# Altium schematic sheet Power_Input.SchDoc: Power input
size A4; SheetNumber: 1; SheetTotal: 10
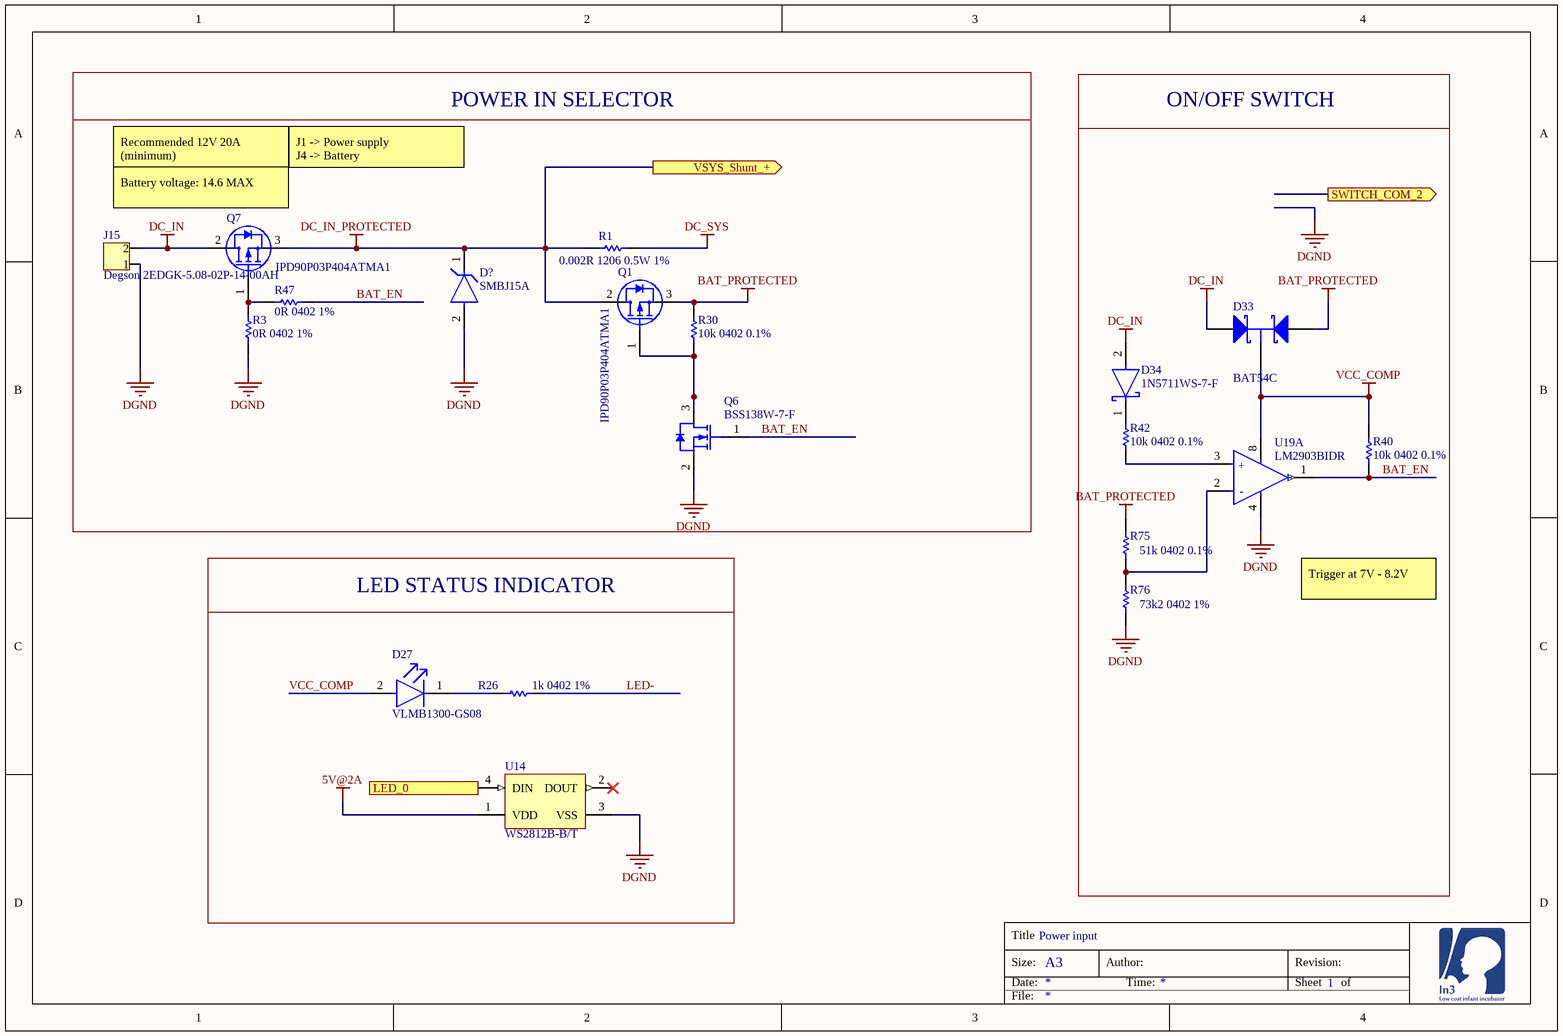
[diagram p0: Power_Input.SchDoc]

## Parts
D27  VLMB1300-GS08  [FP-6_541-5094_01-4-MFG]
D33  BAT54C  [NXP-SOT23-3_V]
D34  1N5711WS-7-F  [FP-SOD323-MFG]
D?  SMBJ15A  [FP-SMBJ-MFG]
J15  Degson 2EDGK-5.08-02P-14-00AH  [PCB-h4cyb3wxd4gf7j132tzl-1]
Q1  IPD90P03P404ATMA1  [DPAK IPD90P03P404ATMA1]
Q6  BSS138W-7-F  [DIOD-SOT323-3_V]
Q7  IPD90P03P404ATMA1  [DPAK IPD90P03P404ATMA1]
R1  0.002R 1206 0.5W 1%  [CAPC3216X180X55ML20T25]
R3  0R 0402 1%  [RESC1005X40X25ML05T10]
R26  1k 0402 1%  [RESC1005X40X25ML05T10]
R30  10k 0402 0.1%  [RESC1005X40X25ML05T10]
R40  10k 0402 0.1%  [RESC1005X40X25ML05T10]
R42  10k 0402 0.1%  [RESC1005X40X25ML05T10]
R47  0R 0402 1%  [RESC1005X40X25ML05T10]
R75  51k 0402 0.1%  [RESC1005X40X25ML05T10]
R76  73k2 0402 1%  [RESC1005X40X25ML05T10]
U14  WS2812B-B/T  [ADA-RGB-1655_V]
U19  LM2903BIDR  [FP-D0008A-MFG]  (part A of 2)

## Blocks framed on the sheet
POWER IN SELECTOR: D? J15 Q1 Q6 Q7 R1 R3 R30 R47
ON/OFF SWITCH: D33 D34 R40 R42 R75 R76 U19
LED STATUS INDICATOR: D27 R26 U14

## Ports
LED_0 (out), SWITCH_COM_2 (out), VSYS_Shunt_+ (out)

## Nets
5V@2A: U14.1(VDD)
BAT_PROTECTED: D33.2(A) Q1.3(S) R30.1 R75.2
DC_IN: D33.1(A) D34.2(A) J15.2 Q7.2(D)
DC_IN_PROTECTED: D?.1(C) Q1.2(D) Q7.3(S) R1.2 ; port VSYS_Shunt_+
DC_SYS: R1.1
DGND: D?.2(A) J15.1 Q6.2(S) R3.2 R76.1 U14.3(VSS) U19.4(GND)
VCC_COMP: D27.2(A) D33.3(K) R40.1 U19.8(VCC)
BAT_EN: Q6.1(G) R40.2 R47.2 U19.1(1OUT)
LED-: R26.1
LED_0: U14.4(DIN) ; port LED_0
NetD27_1: D27.1(C) R26.2
NetD34_1: D34.1(C) R42.2
NetQ1_1: Q1.1(G) Q6.3(D) R30.2
NetQ7_1: Q7.1(G) R3.1 R47.1
NetR42_1: R42.1 U19.3(1IN+)
NetR75_1: R75.1 R76.2 U19.2(1IN-)

Not connected (* = marked no-connect by the designer): U14 2(DOUT)*

## Notes on the sheet
- Recommended 12V 20A (minimum)
- J1 -> Power supply
  J4 -> Battery
- Battery voltage: 14.6 MAX
- Trigger at 7V - 8.2V
- Title
- Size:
- Date:
- A3
- Author:
- Time:
- Revision:
- Sheet
- of
- File:
- (in symbol CMP-04896-000007-1, part A) +; -

## Library data of the parts
D27 = CMP-02520-000013-1: LED BLUE 0603 SMD; Manufacturer: Vishay Semiconductor Opto Division; Forward Current: 20mA; Wavelength: 475nm; Viewing Angle: 130°; Forward Voltage: 3.8V; Power Dissipation: 76mW; Luminous Intensity: 28-180mcd; Led Orientation: Top View; Peak Emmision Wavelength: 468nm; RoHS: TRUE; ComponentLink2URL: http://www.vishay.com/docs/82437/vlmo1300.pdf; Ambient Temperature Range Low: -20°C; ComponentLink2Description: Datasheet; Mouser Description: LED; SMD; 0603; blue; 28-180mcd; 1.6x0.8x0.8mm; 130°; 2.8÷3.8V; 20mA; Manufacturer Part Number: VLMB1300-GS08; Package: 6.541-5094.01-4; Device Class L3: unset; Automotive: No; Temperature: -20°C to +80°C; Colour: Blue; Digikey Description: LED BLUE 0603 SMD; Device Class L2: LEDs; Temperature Range Low: -20°C; Lead Free: Yes; Category: Diode; Device Class L1: Optoelectronics; Height: 1mm; Octopart: https://octopart.com/vlmb1300-gs08-vishay-22022408; Temperature Range High: +80°C; Ambient Temperature Range High: +80°C; LCSC_PN: C435849
D33 = CMP-0417-00003-1: Schottky Barrier Diode, 30 V, 2 uA, -55 to 150 degC, 3-Pin SOT23, RoHS, Tape and Reel; Manufacturer: NXP Semiconductors; IR (uA): 2; VF (mV): 800; Trr (ns): 5; Cd (pF): 10; VR (V): 30; Rth(j-a) (K/W): 500; RoHS: TRUE; Packing: Tape and Reel; ComponentLink2URL: http://www.nxp.com/documents/data_sheet/BAT54_SER.pdf; PartNumber: BAT54C; ComponentLink2Description: Datasheet; Temperature Range: -55 to 150 degC; PackageReference: SOT23-3; PackageDescription: 3-Pin Plastic Surface-mounted Package, Body 1.3 x 2.9 mm, Pitch 0.95 mm; Mounting Technology: Surface Mount; ComponentLink1URL: http://www.nxp.com/; DatasheetVersion: Rev. 5; ComponentLink1Description: Manufacturer URL; LCSC_PN: C181200
D34 = CMP-12790-000032-1: DIODE SCHOTTKY 70V 150MW SOD323; Manufacturer: Diodes Inc; Value: 2pF; Standoff Height: 0.05mm; Max Junction Temp: +125°C; Forward Current: 15mA; Reverse Voltage: 49V; Category: Diode; Temperature: -55°C to +125°C; Digikey Description: DIODE SCHOTTKY 70V 150MW SOD323; Octopart: https://octopart.com/1n5711ws-7-f-diodes+inc.-323167; Manufacturer Part Number: 1N5711WS-7-F; Temperature Range High: +125°C; Lead Free: Yes; RoHS: TRUE; Device Class L2: Diodes; Height: 1.2mm; Automotive: No; Device Class L1: Discrete Semiconductors; Capacitance: 2pF; ComponentLink2URL: https://www.diodes.com/assets/Datasheets/ds31033.pdf; Temperature Range Low: -55°C; Max Repetitive Reverse Voltage: 70V; ComponentLink2Description: Datasheet; Package: SOD323; Device Class L3: Schottky Diodes; Mouser Description: Schottky Diodes & Rectifiers 70V 200mW; Footprint Url: https://www.diodes.com/assets/Package-Files/SOD323.pdf; LCSC_PN: C151442
D? = CMP-07401-000033-1: TVS DIODE 15VWM 24.4VC SMB; Max Breakdown Voltage: 19.2V; Reverse Standoff Voltage: 15V; Number of Elements: 1; Diode Type: ZENER; Max Reverse Leakage Current: 5uA; Operating Supply Voltage: 3.5V; Element Configuration: Single; Reverse Breakdown Voltage: 16.7V; Peak Pulse Power: 600W; Peak Pulse Current: 24A; Polarity: Unidirectional; Clamping Voltage: 24.4V; ESD Protection: Yes; Test Current: 1mA; Power Line Protection: No; Max Surge Current: 100A; Min Operating Temperature: -55°C; Number of Pins: 2; Case/Package: DO-214AA; Number of Channels: 1; Series: SMBJ; Height: 2.42mm; Resistor Type: Zener; Max Power Dissipation: 600W; REACH SVHC: No SVHC; Package Quantity: 1; Breakdown Voltage: 19.2V; Radiation Hardening: No; Direction: Unidirectional; Number of Unidirectional Channels: 1; Termination: SMD/SMT; Length: 4.57mm; Width: 3.94mm; Packaging: Tape and Reel; Leakage Current: 5uA; RoHS Compliant: Yes; Mount: Surface Mount; Min Breakdown Voltage: 16.7V; Max Operating Temperature: 150°C
J15 = CMP-7a42b7ee166ba585-1: Terminal block, 5mm 2 Pos, through hole male.; Manufacturer Part Number: 2EDGK-5.08-02P-14-00AH + 2EDGVC-5.08-02P; Octopart URL: https://octopart.com/2edgk-5.08-02p-14-00ah-degson-78006607; OctopartID: 7a42b7ee166ba585; Manufacturer Part Number 2: WJ2EDGVC-5.08-2P + WJ2EDGK-5.08-2P; LCSC Part: C8445; LCSC_PN: C8445
Q1 Q7 = CMP-3103264-6: Single P-Channel 30 V 4.5 mOhm 100 nC OptiMOS Power Mosfet - TO-252-3-11; Lead-Free Status: Lead Free; REACH SVHC Compliance: No SVHC; Octopart URL: https://octopart.com/ipd90p03p404atma1-infineon-21386769; Polarity: P-Channel; RoHS: Compliant; Mounting Style: Surface Mount; Operating Temperature: 175 °C (max); Packaging: Reel; Number of Pins: 3; OctopartID: f6ad3ee185da296a; Manufacturer Part Number: IPD90P03P404ATMA1; Manufacturer Part Number 2: WSF70P03; LCSC_PN: C148439
Q6 = CMP-2000-05968-1: N-Channel Enhancement Mode Mosfet, 50 V, 200 mA, -55 to 150 degC, 6-Pin SOT-323, RoHS, Tape and Reel; Typical Turn-Off Delay Time: 20ns; Number of Channels: 1Channel; Type: EnhancementModeFieldEffectTransistor; Brand: DiodesIncorporated; Vds - Drain-Source Breakdown Voltage: 75V; Vgs - Gate-Source Voltage: 20V; Rds On - Drain-Source Resistance: 1.4Ohms; Transistor Type: 1N-Channel; Configuration: Single; Unit Weight: 0.000212oz; Pd - Power Dissipation: 200mW; Id - Continuous Drain Current: 200mA; Forward Transconductance - Min: 0.1S; Manufacturer URL: http://www.diodes.com/; Series: BSS138; Package Description: 3-Pin Small Outline Transistor, Body 2 x 1.25 mm, Pitch 0.65 mm; Mounting Technology: SurfaceMount; Product Category: MOSFET; RoHS: True; Maximum Operating Temperature: +150C; Height: 1mm; Length: 2.2mm; Technology: Si; Width: 1.35mm; Datasheet URL: http://www.diodes.com/_files/datasheets/ds30206.pdf; Manufacturer: DiodesIncorporated; Package / Case: SOT-323-3; Typical Turn-On Delay Time: 20ns; Transistor Polarity: N-Channel; Factory Pack Quantity: 3000; Packaging: Reel; Product: MOSFETSmallSignal; Datasheet Version: Rev. 11-2, 09/2013; Package Reference: SOT323; Minimum Operating Temperature: -55C; Mounting Style: SMD/SMT; Channel Mode: Enhancement; LCSC_PN: C24553
R1 = CMP-0abdc173b10ad57a-1: Manufacturer Part Number: WSLP12065L000FEA; Resistance: 0,002; Power: 1W; Octopart URL: https://octopart.com/1-2176055-0-te+connectivity-46440145; Case/Package: 1206; Lifecycle Status: Not Listed by Manufacturer; Packaging: Tape & Reel (TR); OctopartID: 0abdc173b10ad57a; OrderingCode: WSLP12065L000FEA; Manufacturer Part Number 2: FMF06FTHR005-LHL; LCSC_PN: C601094
R3 R26 R30 R40 R42 R47 R75 = CMP-2002-07472-1
  R3 R47: LCSC_PN: C60485
  R26: LCSC_PN: C106235
  R30 R40 R42: LCSC_PN: C190095
  R75: LCSC_PN: C149896
R76 = CMP-2002-07472-1: Manufacturer: Yageo / Phycomp; LCSC_PN: C185398
U14 = CMP-2000-05026-1: Intelligent Control LED Integrated Light Source, 3.5 to 5.3 V, -25 to 80 degC, 4-Pin SMD, RoHS, Tape and Reel; Manufacturer: Adafruit-Industries-LLC; Number of LEDs: 10; Configuration: Discrete; Utilized LED: WS2812(5050); Datasheet URL: http://datasheet.octopart.com/ADA1655-Adafruit-Industries-datasheet-32028139.pdf; Series: Neopixel; Interface: -; Package Description: 4-Pin Surface Mount Device, Body 5 x 5 mm; Color: Red,Green,Blue(RGB); Category: Optoelectronics; Controller Type: -; Package Reference: 1655; Manufacturer URL: https://www.adafruit.com/; Mounting Type: SurfaceMount; Datasheet Version: May-13; Size / Dimension: 5.00mmLx5.00mmW; Family: Addressable,Specialty; LCSC_PN: C2761795
U19 = CMP-04896-000007-1: 36V JI.3 DUAL COMPARATOR; Manufacturer: Texas Instruments; Input Bias Current: -0.0035uA; Standoff Height: 0.11mm; Output Current Per Channel: 25mA; Response Time: 1us; Input Offset Voltage: 4mV; Number Of Channels: 2; Min Supply Voltage: 3V; Nominal Supply Current: 400-550uA; Max Junction Temp: +150°C; Max Supply Voltage: 36V; Height: 1.75mm; Ambient Temperature Range High: +125°C; Lead Free: Yes; Package: D0008A; Octopart: https://octopart.com/lm2903bidr-texas+instruments-104977165; Temperature Range High: +125°C; Device Class L1: Integrated Circuits (ICs); Ambient Temperature Range Low: -40°C; Temperature: -40°C to +125°C; Manufacturer Part Number: LM2903BIDR; Device Class L3: Comparators; Temperature Range Low: -40°C; Category: IC; ComponentLink2Description: Datasheet; ComponentLink2URL: http://www.ti.com/lit/ds/symlink/lm2903b.pdf; RoHS: TRUE; Device Class L2: Linear ICs; Digikey Description: 36V JI.3 DUAL COMPARATOR; Automotive: No; LCSC_PN: C2869804